# EAGLE design 808_bass_drum (EAGLE 7.2.0)
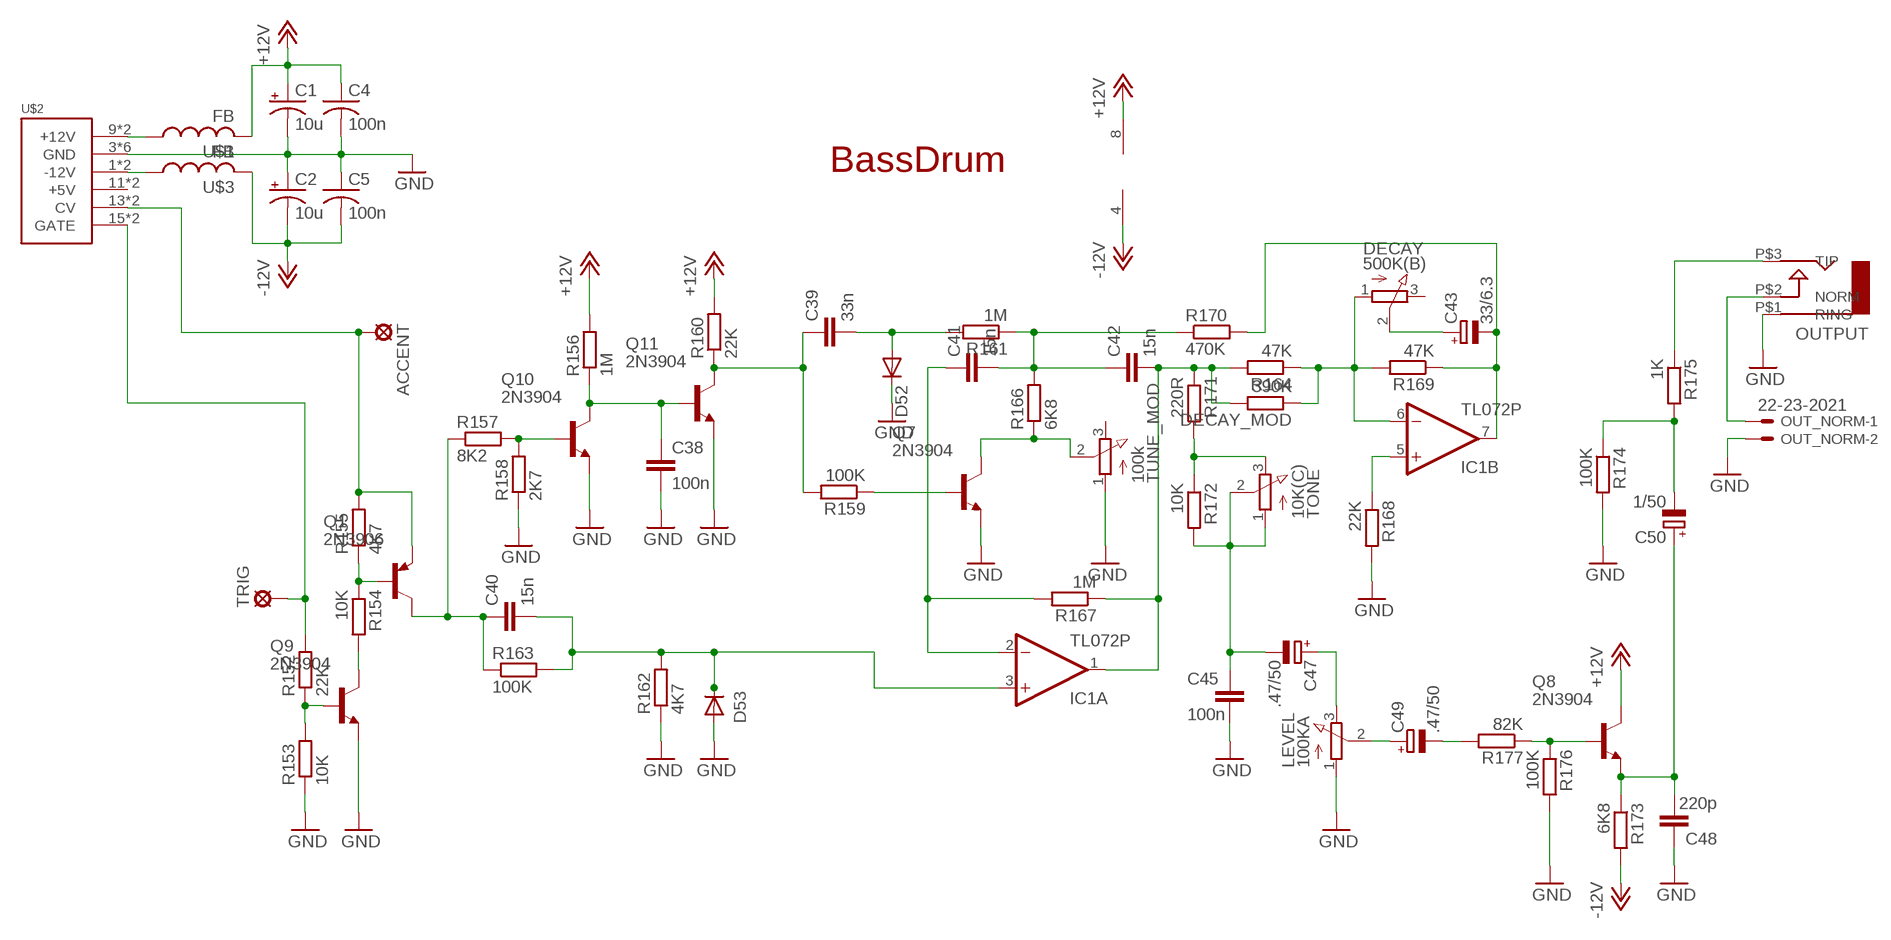
[diagram p0: schematic, sheet 1]

## Parts
ACCENT  LSP10  [LSP10]
C1  10u  CPOL-USB45181A  [B45181A]
C2  10u  CPOL-USB45181A  [B45181A]
C4  100n  C-US050-024X044  [C050-024X044]
C5  100n  C-US050-024X044  [C050-024X044]
C38  100n  C-EU050-024X044  [C050-024X044]
C39  33n  C-EU050-024X044  [C050-024X044]
C40  15n  C-EU050-024X044  [C050-024X044]
C41  15n  C-EU050-024X044  [C050-024X044]
C42  15n  C-EU050-024X044  [C050-024X044]
C43  33/6.3  CPOL-EUE2.5-5  [E2,5-5]
C45  100n  C-EU050-024X044  [C050-024X044]
C47  .47/50  CPOL-EUE2.5-5  [E2,5-5]
C48  220p  C-EU050-025X075  [C050-025X075]
C49  .47/50  CPOL-EUE2.5-5  [E2,5-5]
C50  1/50  CPOL-EUE2.5-5  [E2,5-5]
D52  1N4148DO35-7  [DO35-7]
D53  1N4148DO35-7  [DO35-7]
DECAY  500K(B)  3RP/1610N  [3RP/1610N]
DECAY_MOD  390K  R-EU_0207/7  [0207/7]
IC1  TL072P  [DIL08]
LEVEL  100KA  3RP/1610N  [3RP/1610N]
OUT_NORM  22-23-2021  [22-23-2021]
OUTPUT  AUDIO-JACK  [ERTHENVAR-JACK-90DEG]
Q1  2N3906  [TO92]
Q7  2N3904  [TO92]
Q8  2N3904  [TO92]
Q9  2N3904  [TO92]
Q10  2N3904  [TO92]
Q11  2N3904  [TO92]
R152  22K  R-EU_0207/5V  [0207/5V]
R153  10K  R-EU_0207/5V  [0207/5V]
R154  10K  R-EU_0207/5V  [0207/5V]
R155  4K7  R-EU_0207/5V  [0207/5V]
R156  1M  R-EU_0207/7  [0207/7]
R157  8K2  R-EU_0207/5V  [0207/5V]
R158  2K7  R-EU_0207/5V  [0207/5V]
R159  100K  R-EU_0207/7  [0207/7]
R160  22K  R-EU_0207/7  [0207/7]
R161  1M  R-EU_0207/7  [0207/7]
R162  4K7  R-EU_0207/5V  [0207/5V]
R163  100K  R-EU_0207/2V  [0207/2V]
R164  47K  R-EU_0207/7  [0207/7]
R166  6K8  R-EU_0309/10  [0309/10]
R167  1M  R-EU_0207/7  [0207/7]
R168  22K  R-EU_0207/7  [0207/7]
R169  47K  R-EU_0207/7  [0207/7]
R170  470K  R-EU_0207/7  [0207/7]
R171  220R  R-EU_0207/7  [0207/7]
R172  10K  R-EU_0207/5V  [0207/5V]
R173  6K8  R-EU_0207/7  [0207/7]
R174  100K  R-EU_0207/7  [0207/7]
R175  1K  R-EU_0207/7  [0207/7]
R176  100K  R-EU_0309/10  [0309/10]
R177  82K  R-EU_0309/10  [0309/10]
TONE  10K(C)  3RP/1610N  [3RP/1610N]
TRIG  LSP10  [LSP10]
TUNE_MOD  100k  3RP/1610N  [3RP/1610N]
U$1  FB  [FB]
U$2  POWER  [POWER_16]
U$3  FB  [FB]

## Nets
+12V: C1.+ C4.1 IC1.8(P:V+) Q8.1(C) R156.2 R160.2 U$1.P$2
-12V: C2.- C5.2 IC1.4(P:V-) R173.2 U$3.P$2
C49: C49.- R177.2
GND [GND]: C1.- C2.+ C4.2 C5.1 C38.2 C45.2 C48.1 D52.C D53.A LEVEL.1(A) OUT_NORM.2 OUTPUT.P$1(RING) Q7.3(E) Q9.3(E) Q10.3(E) Q11.3(E) R153.1 R158.1 R162.1 R168.2 R174.2 R176.2 TUNE_MOD.1(A) U$2.3(GND) U$2.4(GND) U$2.5(GND) U$2.6(GND) U$2.7(GND) U$2.8(GND)
LT_LC_OUT: OUTPUT.P$3(TIP) R175.1
N$1: DECAY.1(A) DECAY_MOD.1 IC1.6(B:-IN) R164.1 R169.2
N$2: IC1.5(B:+IN) R168.1
N$3: C39.2 D52.A R161.2
N$4: R152.2 TRIG.MP U$2.15(GATE) U$2.16(GATE)
N$5: U$1.P$1 U$2.9(+12V) U$2.10(+12V)
N$6: U$2.1(-12V) U$2.2(-12V) U$3.P$1
N$7: OUT_NORM.1 OUTPUT.P$2(NORM)
N$162: C38.1 Q10.1(C) Q11.2(B) R156.1
N$164: Q1.2(B) R154.1 R155.1
N$168: Q7.1(C) R166.1 TUNE_MOD.2(S)
N$169: Q10.2(B) R157.2 R158.2
N$188: Q9.1(C) R154.2
N$190: C39.1 Q11.1(C) R159.2 R160.1
N$191: C40.1 Q1.1(C) R157.1 R163.1
N$192: C40.2 D53.C IC1.3(A:+IN) R162.2 R163.2
N$193: Q7.2(B) R159.1
N$195: C41.2 C42.1 R161.1 R166.2 R170.1
N$196: C41.1 IC1.2(A:-IN) R167.2
N$197: C42.2 DECAY_MOD.2 IC1.1(A:OUT) R164.2 R167.1 R171.1
N$198: C45.1 C47.- R172.2 TONE.1(A) TONE.2(S)
N$199: R171.2 R172.1 TONE.3(E)
N$202: C43.- IC1.7(B:OUT) R169.1 R170.2
N$203: Q8.2(B) R176.1 R177.1
N$204: C48.2 C50.+ Q8.3(E) R173.1
N$205: C50.- R174.1 R175.2
N$206: C47.+ LEVEL.3(E)
N$207: C49.+ LEVEL.2(S)
N$208: C43.+ DECAY.2(S)
N$217: Q9.2(B) R152.1 R153.2
TRIG: ACCENT.MP Q1.3(E) R155.2 U$2.13(CV) U$2.14(CV)
Unconnected: DECAY.3(E) TUNE_MOD.3(E) U$2.11(+5V) U$2.12(+5V)

## Notes on the sheet
- BassDrum

## Library data of the parts
ACCENT TRIG = solpad:LSP10: SOLDER PAD drill 1.0 mm, distributor Buerklin, 12H555
C1 C2 = rcl:CPOL-US: POLARIZED CAPACITOR, American symbol
C4 C5 = rcl:C-US: CAPACITOR, American symbol
C38-C42 C45 C48 = TR808clone:C-EU: CAPACITOR, European symbol Pitch 3mm
C43 C47 C49 C50 = TR808clone:CPOL-EU: POLARIZED CAPACITOR, European symbol
D52 D53 = TR808clone:1N4148: DIODE high speed (Philips)
DECAY LEVEL TONE TUNE_MOD = pot:3RP/1610N: 16mm Potentiometer one level Source: http://www.alphapotentiometers.net/html/16mm_pot_2.html
DECAY_MOD R152-R164 R166-R177 = TR808clone:R-EU_: RESISTOR, European symbol
IC1 = linear:TL072: OP AMP
OUT_NORM = con-molex:22-23-2021: .100" (2.54mm) Center Header - 2 Pin; MF: MOLEX; MPN: 22-23-2021; OC_FARNELL: 1462926; OC_NEWARK: 25C3832
OUTPUT = erthenvar:AUDIO-JACK: Switching Mono 3.5mm Audio Jack from Erthenvar.
Q1 = 808_lt:2N3906: PNP Transistor
Q7-Q11 = 808_lt:2N3904: NPN Transistor
U$1 U$3 = adafruit:FB: Ferrite bead Digikey #P9821BK-ND
U$2 = eurorack:POWER

## Net classes
0 default: width 0.635 mm, drill 0.254 mm, clearance 0.254 mm
1 GND: width 1.016 mm, drill 1.016 mm, clearance 0.508 mm
2 Power: width 1.016 mm, drill 1.016 mm, clearance 0.508 mm
3 special: width 0.635 mm, drill 0.254 mm, clearance 0.254 mm
4 15v: width 1.524 mm, drill 1.016 mm, clearance 0.508 mm

## Board
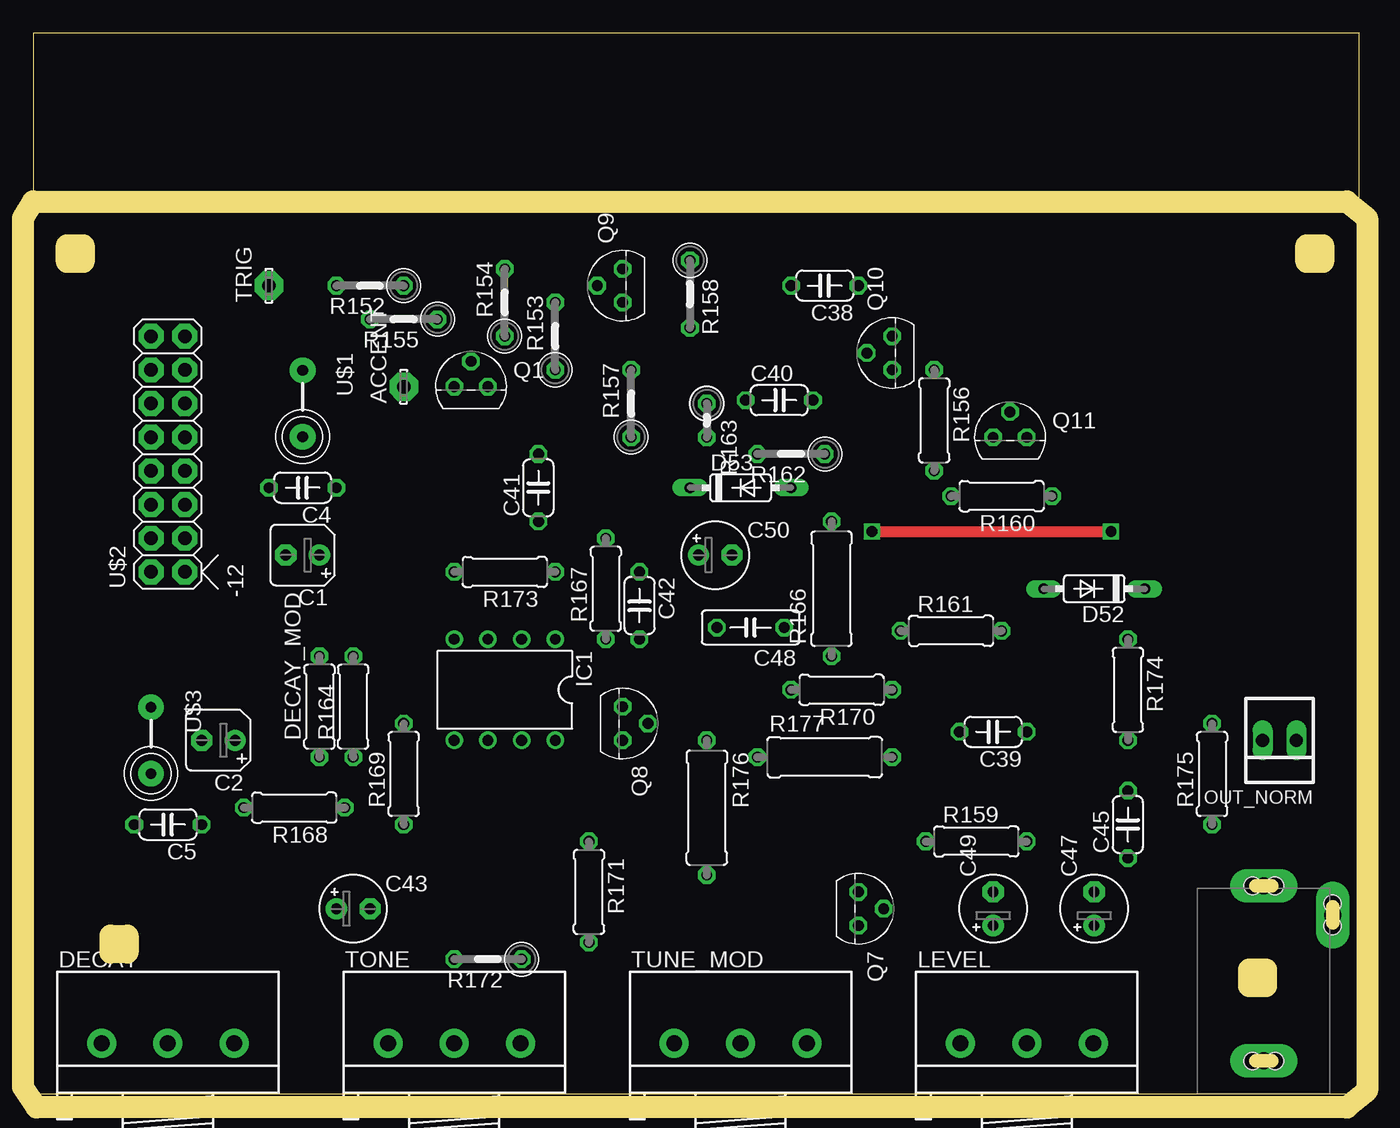
[diagram p1: board, top side]
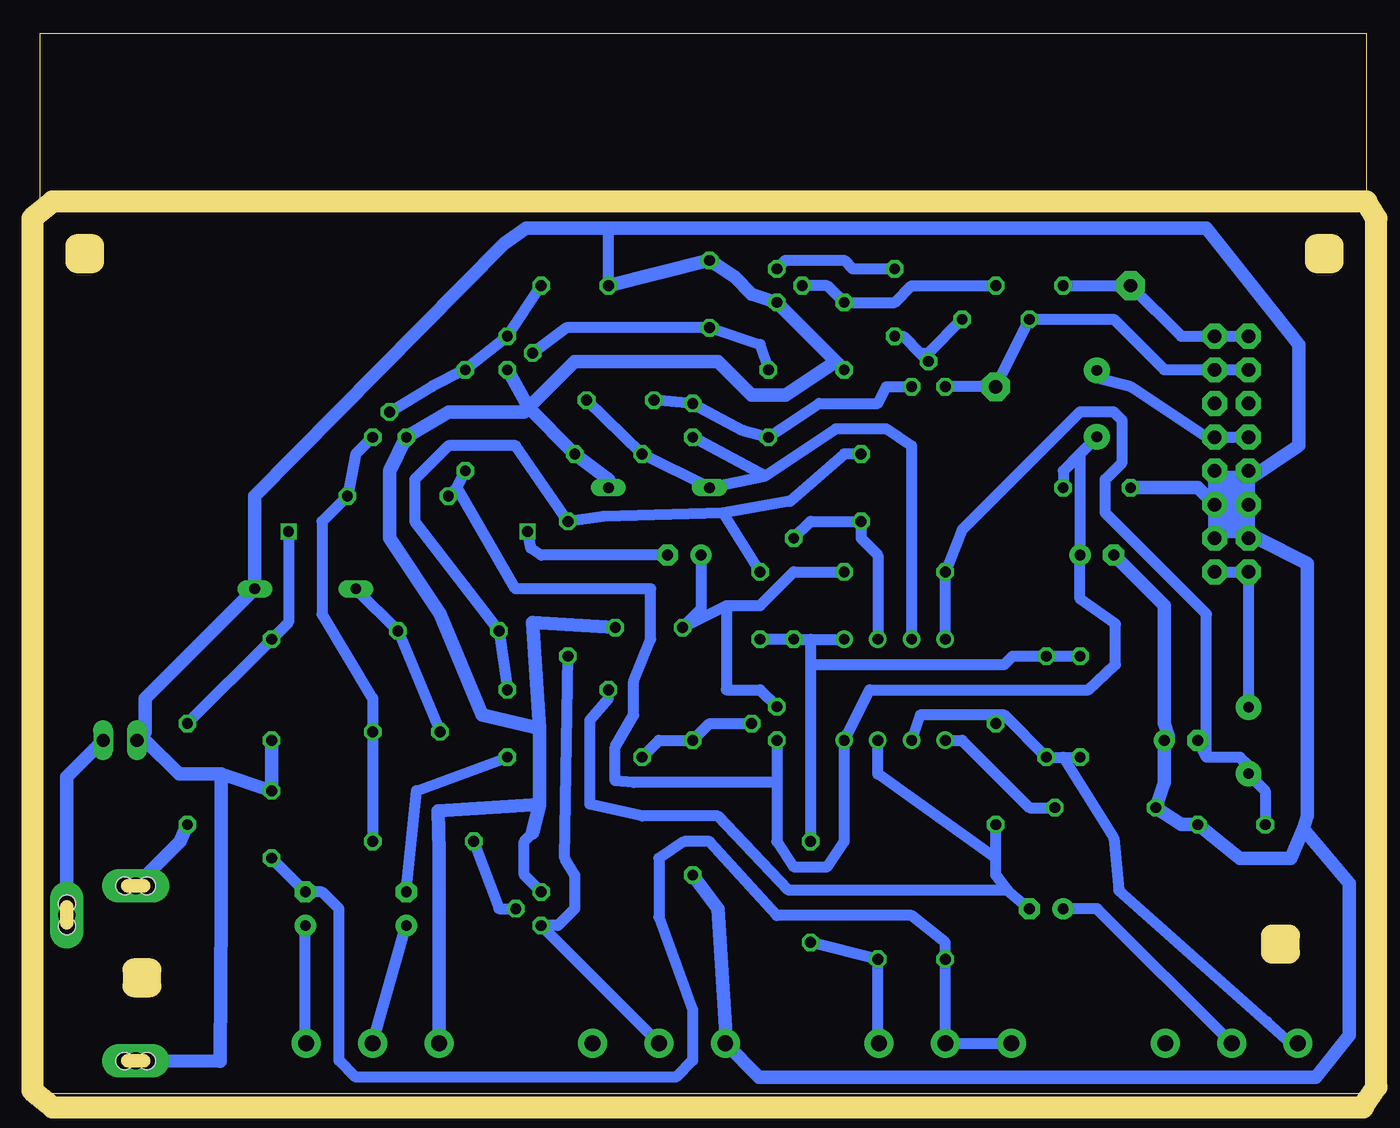
[diagram p2: board, bottom side, seen from below]

Size 100 x 80 mm. Coordinates in mm from the lower left corner, seen from the top.
Outline: 0,0 100,0 100,80 0,80 0,0
Copper layers (1*16): Top 0.035mm / dielectric 1.5mm / Bottom 0.035mm
Design rules "default *": minimum track width 32mil, minimum drill 31mil, track to track 18mil, track to pad 18mil, pad to pad 18mil, via to via 18mil, smd to smd 8mil, copper to edge 0mil, drill to drill 18mil, minimum pad ring 10mil, minimum via ring 8mil, stop-mask expansion 4mil, vias tented up to drill 0mil, thermal gap 10mil
Milling: 24 lines

### Footprints (pad centres in the part's own frame; a part is rotated, then mirrored left to right if it is on the bottom)
LSP10 = drill 1.016 pad 2.159 octagon: MP 0,0
B45181A = drill 0.813 pad 1.6: + -1.27,0 | drill 0.813 pad 1.6 octagon: - 1.27,0
C050-024X044 = drill 0.813 octagon: 1 -2.54,0; 2 2.54,0
E2,5-5 = drill 0.813 pad 1.6: + -1.27,0 | drill 0.813 pad 1.6 octagon: - 1.27,0
C050-025X075 = drill 0.813 octagon: 1 -2.54,0; 2 2.54,0
DO35-7 = drill 0.813 long: A 3.81,0; C -3.81,0
3RP/1610N = drill 1.2 pad 2.184: 1 -5,0; 2 0,0; 3 5,0
0207/7 = drill 0.813 octagon: 1 -3.81,0; 2 3.81,0
DIL08 = drill 0.813 pad 1.27: 1 -3.81,-3.81; 2 -1.27,-3.81; 3 1.27,-3.81; 4 3.81,-3.81; 5 3.81,3.81; 6 1.27,3.81; 7 -1.27,3.81; 8 -3.81,3.81
22-23-2021 = drill 1 long: 1 -1.27,0; 2 1.27,0
ERTHENVAR-JACK-90DEG = drill 1.3 pad 2.54 long: P$1 5,-2.5; P$2 -0.2,-13.5; P$3 5,-15.7 | hole 1.3: 5.842,-2.489; 4.14,-2.489; -0.203,-12.649; -0.203,-14.351; 5.842,-15.697; 4.166,-15.697
TO92 = drill 0.813 octagon: 1 1.27,0; 2 0,1.905; 3 -1.27,0
0207/5V = drill 0.813 octagon: 1 -2.54,0; 2 2.54,0
0207/2V = drill 0.813 octagon: 1 -1.27,0; 2 1.27,0
0309/10 = drill 0.813 octagon: 1 -5.08,0; 2 5.08,0
FB = drill 0.8 pad 1.93: P$1 -2.5,0; P$2 2.5,0
POWER_16 = drill 1.016 pad 1.88 octagon: 1 -6.35,-1.27; 2 -6.35,1.27; 3 -3.81,-1.27; 4 -3.81,1.27; 5 -1.27,-1.27; 6 -1.27,1.27; 7 1.27,-1.27; 8 1.27,1.27; 9 3.81,-1.27; 10 3.81,1.27; 11 6.35,-1.27; 12 6.35,1.27; 13 8.89,-1.27; 14 8.89,1.27; 15 11.43,-1.27; 16 11.43,1.27

### Placement (x,y rotation side)
ACCENT  27.94,53.34 90 top
C1  20.32,40.64 180 top
C2  13.97,26.67 180 top
C4  20.32,45.72 180 top
C5  10.16,20.32 180 top
C38  59.69,60.96 180 top
C39  72.39,27.3 180 top
C40  56.26,52.32 0 top
C41  38.1,45.72 90 top
C42  45.72,36.83 270 top
C43  24.13,13.97 0 top
C45  82.55,20.32 90 top
C47  80.01,13.97 90 top
C48  54.1,35.18 180 top
C49  72.39,13.97 90 top
C50  51.44,40.64 0 top
D52  80.01,38.1 180 top
D53  53.34,45.72 0 top
DECAY  10.16,3.81 0 top
DECAY_MOD  21.59,29.21 90 top
IC1  35.56,30.48 180 top
LEVEL  74.93,3.81 0 top
OUT_NORM  93.98,26.67 180 top
OUTPUT  97.79,0 180 top
Q1  33.02,53.34 0 top
Q7  62.23,13.97 270 top
Q8  44.45,27.94 270 top
Q9  44.45,60.96 90 top
Q10  64.77,55.88 90 top
Q11  73.66,49.53 0 top
R152  25.4,60.96 180 top
R153  39.37,57.15 90 top
R154  35.56,59.69 90 top
R155  27.94,58.42 180 top
R156  67.94,50.8 270 top
R157  45.09,52.07 90 top
R158  49.53,60.33 270 top
R159  71.12,19.05 0 top
R160  73.03,45.09 180 top
R161  69.22,34.92 0 top
R162  57.15,48.26 180 top
R163  50.8,50.8 270 top
R164  24.13,29.21 90 top
R166  60.2,38.1 90 top
R167  43.18,38.1 90 top
R168  19.68,21.59 180 top
R169  27.94,24.13 90 top
R170  60.96,30.48 180 top
R171  41.91,15.24 270 top
R172  34.29,10.16 180 top
R173  35.56,39.37 180 top
R174  82.55,30.48 270 top
R175  88.9,24.13 90 top
R176  50.8,21.59 270 top
R177  59.69,25.4 0 top
TONE  31.75,3.81 0 top
TRIG  17.78,60.96 90 top
TUNE_MOD  53.34,3.81 0 top
U$1  20.32,52.07 270 top
U$2  10.16,45.72 90 top
U$3  8.89,26.67 270 top

### Tracks (layer width: path | path; a pad name or v marks a point on that pad's centre or on a via)
+12V
  Bottom 0.813: C4.1 22.86,46.99 21.59,48.26 | 21.59,48.26 20.32,49.53 U$1.P$2 | 21.59,48.26 C1.+ 21.59,37.34 18.92,35.43 18.92,32.38 20.95,30.48 37.47,30.48 IC1.8 39.37,19.05 40.64,17.14 43.18,17.14 44.45,19.05 44.45,23.5 | 68.58,45.72 R156.2 | R160.2 68.58,45.72 | Q8.1 44.45,23.5 | 68.58,45.72 64.14,38.1 53.98,38.1 53.98,34.29 55.24,31.11 55.24,28.57 56.64,26.16 56.64,23.62 55.24,23.5 44.45,23.5
-12V
  Bottom 0.813: IC1.4 R173.2 30.48,42.55 21.59,51.44 19.05,51.44 18.41,50.8 18.41,47.62 19.68,46.35 19.68,43.81 12.06,36.2 12.06,25.4 | C5.2 7.62,22.86 8.89,24.13 U$3.P$2 8.89,24.77 9.53,25.4 12.06,25.4 | 12.06,25.4 C2.-
C49
  Bottom 0.813: R177.2 71.63,22.86 C49.-
GND
  Bottom 0.813: Q7.3 63.5,16.51 63.5,19.05 62.87,19.68 | C38.2 57.15,65.28
  Bottom 1.016: D53.A 57.15,46.35 R162.1 63.18,51.75 | 63.18,51.75 Q10.3 | 63.18,51.75 63.5,51.44 69.22,51.44 Q11.3 73.66,46.99 73.66,41.91 69.85,36.2 66.67,28.57 62.36,27.56 | C48.1 62.87,35.56 62.36,27.56 | 62.87,19.68 62.36,21.84 | 62.36,21.84 62.36,27.56 | C38.2 R158.1 47.62,61.59 46.35,60.33 Q9.3 40.01,55.24 | 40.01,55.24 R153.1 | R174.2 C45.2 86.36,24.13 | 86.36,24.13 89.53,24.13 92.08,26.67 OUT_NORM.2 92.08,27.3 92.08,29.84 D52.C 83.82,45.09 65.02,64.14 63.37,65.28 57.15,65.28 12.06,65.28 5.08,56.52 5.08,48.9 8.89,46.35 | 63.18,51.75 59.69,55.24 48.9,55.24 46.35,52.7 43.81,52.7 40.01,55.24 | R176.2 48.9,13.97 48.26,3.81 TUNE_MOD.1 45.8,1.27 3.81,1.27 1.27,4.45 1.27,15.88 4.76,20 | U$2.6 U$2.4 8.26,41.91 4.45,40.01 4.45,20.95 4.76,20 | U$2.6 8.89,46.35 | C4.2 12.7,45.72 U$2.5 | U$2.5 U$2.3 | U$2.5 U$2.7 | U$2.5 U$2.6 | C1.- 15.24,36.83 15.24,27.94 14.92,26.99 C2.+ 15.24,23.5 R168.2 13.97,20.32 C5.1 9.53,17.78 5.71,17.78 4.76,20 | 8.89,46.35 U$2.8 | 69.93,3.73 LEVEL.1 69.93,18.34 69.98,21.34 62.36,21.84 | OUTPUT.P$1 86.44,2.46 86.36,13.97 86.36,24.13
LT_LC_OUT
  Bottom 1.016: R175.1 89.44,19.05 OUTPUT.P$3
N$1
  Bottom 0.813: 22.86,25.4 R164.1 27.3,28.57 | 22.86,25.4 DECAY_MOD.1 | 27.3,28.57 R169.2 | IC1.6 33.66,28.57 27.3,28.57 | 22.86,25.4 19.05,19.3 18.67,15.37 7.49,5.46 5.71,3.81 DECAY.1
N$2
  Bottom 0.813: R168.1 25.4,21.59 30.48,26.67 IC1.5
N$3
  Bottom 0.813: D52.A R161.2 C39.2
N$4
  Bottom 0.813: U$2.16 U$2.15 13.97,57.15 TRIG.MP R152.2
N$5
  Bottom 0.813: U$2.10 U$2.9 12.06,49.53 17.78,53.34 20.32,53.98 U$1.P$1
N$6
  Bottom 0.813: U$2.1 U$2.2 U$3.P$1
N$7
  Bottom 1.016: OUTPUT.P$2 97.99,23.93 OUT_NORM.1
N$162
  Bottom 0.813: C38.1 Q10.1 R156.1 70.48,53.34 Q11.2
N$164
  Bottom 0.813: 33.66,55.88 34.92,57.15 R154.1 | 33.66,55.88 Q1.2 | R155.1 33.02,55.88 33.66,55.88
N$168
  Bottom 0.813: R166.1 60.45,17.78 59.69,16.51 59.69,13.97 60.96,12.7 Q7.1 TUNE_MOD.2
N$169
  Bottom 0.813: R157.2 45.72,56.52 R158.2 60.33,57.78 Q10.2
N$188
  Bottom 0.813: R154.2 38.73,62.23 39.37,62.87 43.81,62.87 Q9.1
N$190
  Bottom 0.813: R159.2 C39.1 74.93,29.84 78.74,36.2 78.74,43.18 R160.1 76.2,48.26 Q11.1
N$191
  Bottom 0.813: Q1.1 36.2,53.34 36.83,52.07 41.27,52.07 R157.1 46.99,50.04 R163.1 C40.1
N$192
  Bottom 0.813: IC1.3 34.29,48.9 36.2,50.16 40.01,50.16 45.34,46.61 | 45.34,46.61 D53.C R162.2 C40.2 | 45.34,46.61 R163.2
N$193
  Bottom 0.813: Q7.2 65.41,13.97 R159.1
N$195
  Bottom 0.813: R170.1 R161.1 71.75,43.18 71.75,46.35 69.22,48.9 64.14,48.9 R166.2 57.53,43.56 48.51,43.81 | 48.51,43.81 43.43,44.7 39.37,48.26 C41.2 | 48.51,43.81 C42.1
N$196
  Bottom 0.813: R167.2 41.91,43.18 C41.1 38.1,41.91 36.83,40.64 IC1.2
N$197
  Bottom 0.813: DECAY_MOD.2 R164.2 26.67,33.02 27.3,32.38 41.91,32.38 | 41.91,34.29 R167.1 C42.2 | 41.91,34.29 IC1.1 | 41.91,34.29 41.91,32.38 | 41.91,32.38 R171.1
N$198
  Bottom 0.813: TONE.1 TONE.2 R172.2 31.75,11.43 34.29,13.46 44.45,13.46 49.53,19.05 51.44,19.05 53.34,17.78 53.34,13.34 50.8,6.35 50.8,2.54 52.07,1.27 76.2,1.27 77.47,2.54 77.47,13.97 78.74,15.24 C47.- C45.1
N$199
  Bottom 0.813: TONE.3 36.83,3.81 R172.1 R171.2
N$202
  Bottom 0.813: 27.94,17.78 27.94,16.51 27.05,15.37 | 27.94,17.78 R169.1 | C43.- 27.05,15.37 | 27.94,17.78 36.83,24.13 IC1.7 | R170.2 57.15,29.84 58.55,28.19 58.55,21.84 54.61,20.95 48.9,20.95 43.56,15.37 27.05,15.37
N$203
  Bottom 0.813: R177.1 53.34,26.67 R176.1 49.53,27.94 Q8.2
N$204
  Bottom 0.813: Q8.3 45.72,30.48 48.26,30.48 48.26,36.83 | R173.1 43.18,39.37 45.72,36.83 48.26,36.83 | 48.26,36.83 C48.2 50.16,36.58 C50.+
N$205  (via drill 0.8)
  Top 0.813: v63.25,42.42 v81.28,42.42
  Bottom 0.813: R175.2 R174.1 81.28,35.56 v81.28,42.42 | C50.- 62.23,40.64 62.99,41.15 v63.25,42.42
N$206
  Bottom 0.813: C47.+ 80.01,3.81 LEVEL.3
N$207
  Bottom 0.813: LEVEL.2 C49.+
N$208
  Bottom 0.813: C43.+ 20.32,13.97 DECAY.2
N$217
  Bottom 0.813: R152.1 34.29,60.96 35.56,59.69 R153.2 40.64,60.96 Q9.2
TRIG
  Bottom 0.813: U$2.14 U$2.13 15.24,54.61 19.05,58.42 R155.2 ACCENT.MP Q1.3
(copper drawn outside any net)
  shapes: Bottom area x1